# EAGLE design CAN ESC Adapter v0.1A (EAGLE 9.3.1)
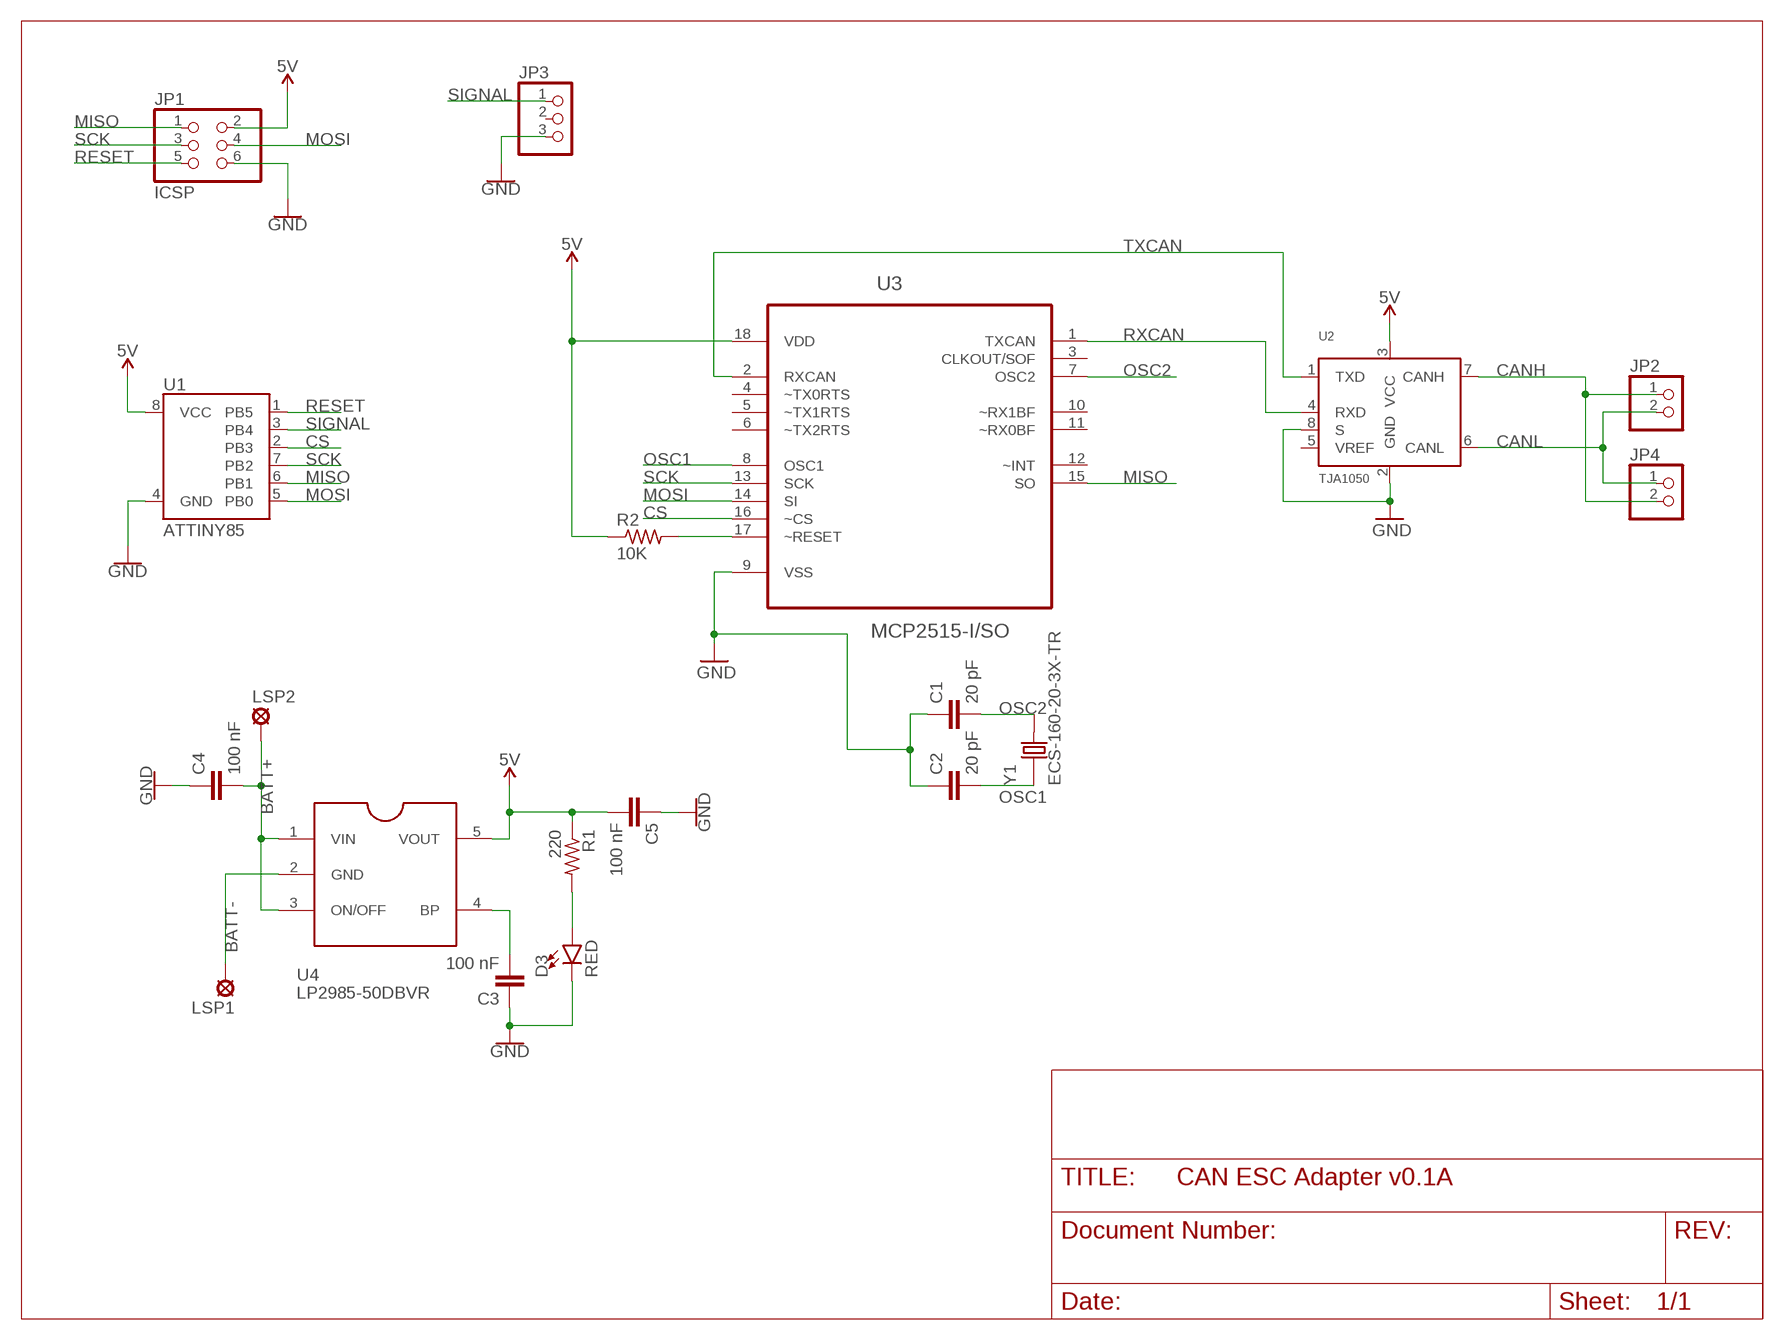
[diagram p0: schematic, sheet 1]

## Parts
C1  20 pF  C-EUC0603  [C0603]
C2  20 pF  C-EUC0603  [C0603]
C3  100 nF  C-EUC0603  [C0603]
C4  100 nF  C-EUC0603  [C0603]
C5  100 nF  C-EUC0603  [C0603]
D3  RED  LED0603  [LED-0603]
JP1  ICSP  PINHD-2X3  [2X03]
JP2  PINHD-1X2/90  [1X02/90]
JP3  PINHD-1X3/90  [1X03/90]
JP4  PINHD-1X2/90  [1X02/90]
LSP1  SE14  [SE14]
LSP2  SE14  [SE14]
R1  220  R-US_R0603  [R0603]
R2  10K  R-US_R0603  [R0603]
U1  ATTINY85  [ATTINY85]
U2  TJA1050  [SOT96-1]
U3  MCP2515-I/SO  [SOIC127P1034X264-18N]
U4  LP2985-50DBVR  [SOT23-5]
Y1  ECS-160-20-3X-TR  [XTAL_ECS-160-20-3X-TR]

## Nets
5V: C5.2 JP1.2 R1.1 R2.1 U1.8(VCC) U2.3(VCC) U3.18(VDD) U4.5(VOUT)
BATT+: C4.2 LSP2.MP U4.1(VIN) U4.3(ON/OFF)
BATT-: LSP1.MP U4.2(GND)
CANH: JP2.1 JP4.2 U2.7(CANH)
CANL: JP2.2 JP4.1 U2.6(CANL)
CS: U1.2(PB3) U3.16(~CS)
GND: C1.1 C2.1 C3.1 C4.1 C5.1 D3.C JP1.6 JP3.3 U1.4(GND) U2.2(GND) U2.8(S) U3.9(VSS)
MISO: JP1.1 U1.6(PB1) U3.15(SO)
MOSI: JP1.4 U1.5(PB0) U3.14(SI)
N$1: D3.A R1.2
N$2: R2.2 U3.17(~RESET)
N$10: C3.2 U4.4(BP)
OSC1: C2.2 U3.8(OSC1) Y1.1
OSC2: C1.2 U3.7(OSC2) Y1.2
RESET: JP1.5 U1.1(PB5)
RXCAN: U2.4(RXD) U3.1(TXCAN)
SCK: JP1.3 U1.7(PB2) U3.13(SCK)
SIGNAL: JP3.1 U1.3(PB4)
TXCAN: U2.1(TXD) U3.2(RXCAN)
Unconnected: JP3.2 U2.5(VREF) U3.3(CLKOUT/SOF) U3.4(~TX0RTS) U3.5(~TX1RTS) U3.6(~TX2RTS) U3.10(~RX1BF) U3.11(~RX0BF) U3.12(~INT)

## Library data of the parts
C1-C5 = rcl:C-EU: CAPACITOR, European symbol; SPICEPREFIX: C
D3 = SparkFun-LED:LED: LED (Generic) Standard schematic elements and footprints for 5mm, 3mm, 1206, and 0603 sized LEDs. Generic LEDs with no color specified.
JP1 = pinhead:PINHD-2X3: PIN HEADER
JP2 JP4 = pinhead:PINHD-1X2: PIN HEADER
JP3 = pinhead:PINHD-1X3: PIN HEADER
LSP1 LSP2 = solpad:SE14: SOLDER PAD E1553, drill 1,4mm, distributor Buerklin, 07F820
R1 R2 = rcl:R-US_: RESISTOR, American symbol; SPICEPREFIX: R
U1 = SparkFun-IC-Microcontroller:ATTINY85; PROD_ID: IC-09092
U2 = TJA1050:TJA1050: High speed CAN transceiver The TJA1050 is the interface between the Controller Area Network (CAN) protocol controller and the physical bus. The device provides differential transmit capability to the bus and differential receive capability to the CAN controller. The TJA1050 is the third Philips high-speed CAN transceiver after the PCA82C250 and the PCA82C251. The most important differences are: Much lower electromagnetic emission due to optimal matching of the output signals CANH and CANL Improved behaviour in case of an unpowered node No standby mode. This makes the TJA1050 eminently suitable for use in nodes that are in a power-down situation in partially powered networks. AAL Eindhoven MK; DIGI-KEY_PART_NUMBER: 568-10292-1-ND; DIGI-KEY_PURCHASE_URL: https://www.digikey.com/product-detail/en/nxp-usa-inc/TJA1050T-CM,118/568-10292-1-ND/4162437?utm_source=snapeda&utm_medium=aggregator&utm_campaign=symbol; MF: NXP USA; MP: TJA1050; PACKAGE: SOIC-8 NXP USA
U3 = MCP2515-I_SO:MCP2515-I/SO: CAN Controller; DESCRIPTION: MCP2515 Series 5.5 V 1 Mb/s Stand Alone SPI Interface CAN Controller- SOIC-18; DIGI-KEY_PART_NUMBER: MCP2515-I/SO-ND; DIGI-KEY_PURCHASE_URL: https://www.digikey.com/product-detail/en/microchip-technology/MCP2515-I-SO/MCP2515-I-SO-ND/593001?utm_source=snapeda&utm_medium=aggregator&utm_campaign=symbol; MF: Microchip; MP: MCP2515-I/SO; PACKAGE: SOIC-18 Microchip
U4 = LP2985-50DBVR:LP2985-50DBVR: http://octopart.com/lp2985-50dbvr-texas+instruments-525993; AVAILABILITY: Unavailable; DESCRIPTION: Single Output LDO, 150mA, Fixed_5.0V_, 1.5% Tolerance, Low Quiescent Current, Low Noise 5-SOT-23 -40 to 125; MF: Texas Instruments; MP: LP2985-50DBVR; PACKAGE: SOT-23 Texas Instruments; PRICE: None
Y1 = ECS-160-20-3X-TR:ECS-160-20-3X-TR: SMD QUARTZ CRYSTAL; AVAILABILITY: Unavailable; DESCRIPTION: CSM-3X Series 16 MHz ±30 ppm 20 pF -10 to +70 °C Surface Mount Quartz Crystal; MF: ECS Inc.; MP: ECS-160-20-3X-TR; PACKAGE: HC49/US ECS International; PRICE: None

## Board
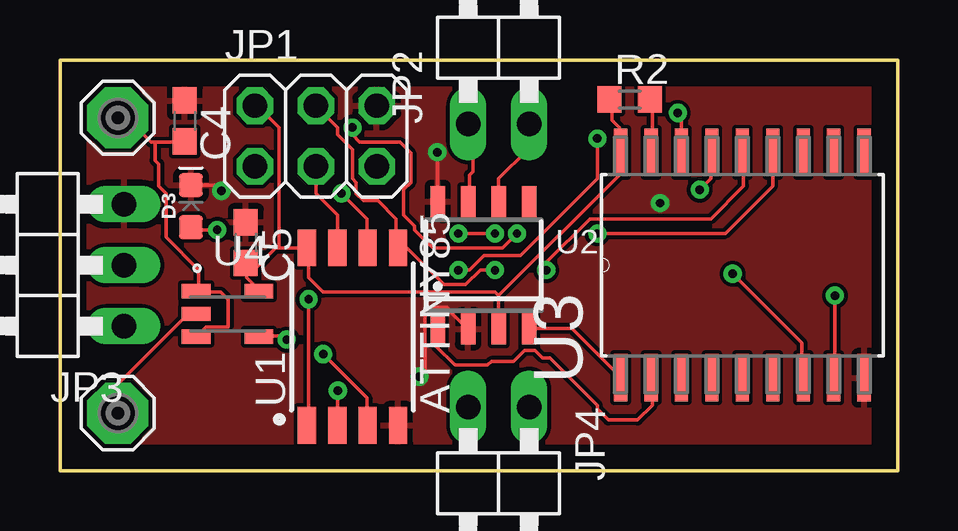
[diagram p1: board, top side]
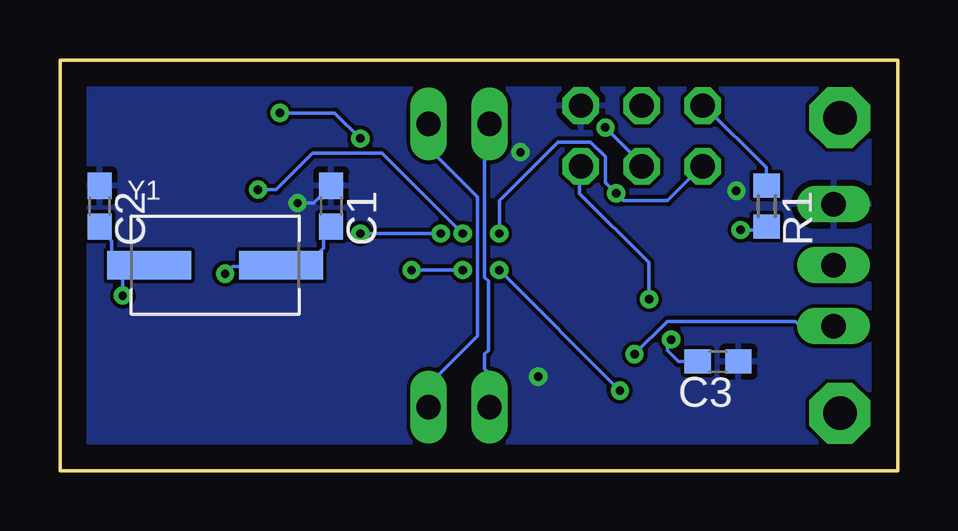
[diagram p2: board, bottom side, seen from below]

Size 34.92 x 17.14 mm. Coordinates in mm from the lower left corner, seen from the top.
Outline: 0,0 34.92,0 34.92,17.14 0,17.14 0,0
Copper layers (1*16): Top 0.035mm / dielectric 1.5mm / Bottom 0.035mm
Design rules "default": minimum track width 6mil, minimum drill 0.35mm, track to track 6mil, track to pad 6mil, pad to pad 6mil, via to via 6mil, smd to smd 6mil, copper to edge 40mil, drill to drill 6mil, minimum pad ring 10mil, minimum via ring 8mil, stop-mask expansion 4mil, vias tented up to drill 0mil, thermal gap 10mil

### Footprints (pad centres in the part's own frame; a part is rotated, then mirrored left to right if it is on the bottom)
C0603 = smd 1.1 x 1: 1 -0.85,0; 2 0.85,0
LED-0603 = smd 1 x 1: A -0.877,0; C 0.877,0
2X03 = drill 1.016 octagon: 1 -2.54,-1.27; 2 -2.54,1.27; 3 0,-1.27; 4 0,1.27; 5 2.54,-1.27; 6 2.54,1.27
1X02/90 = drill 1.016 long: 1 -1.27,-3.81; 2 1.27,-3.81
1X03/90 = drill 1.016 long: 1 -2.54,-3.81; 2 0,-3.81; 3 2.54,-3.81
SE14 = drill 1.397 pad 2.54 octagon: MP 0,0
R0603 = smd 1 x 1.1: 1 -0.85,0; 2 0.85,0
ATTINY85 = smd 1.524 x 0.762: 1 -3.683,1.905; 2 -3.683,0.635; 3 -3.683,-0.635; 4 -3.683,-1.905; 5 3.727,-1.905; 6 3.727,-0.635; 7 3.727,0.635; 8 3.727,1.905
SOT96-1 = smd 0.6 x 1.3: 1 -1.905,-2.65; 2 -0.635,-2.65; 3 0.635,-2.65; 4 1.905,-2.65; 5 1.905,2.65; 6 0.635,2.65; 7 -0.635,2.65; 8 -1.905,2.65
SOIC127P1034X264-18N = smd 1.981 x 0.559: 1 -4.699,5.08; 2 -4.699,3.81; 3 -4.699,2.54; 4 -4.699,1.27; 5 -4.699,0; 6 -4.699,-1.27; 7 -4.699,-2.54; 8 -4.699,-3.81; 9 -4.699,-5.08; 10 4.699,-5.08; 11 4.699,-3.81; 12 4.699,-2.54; 13 4.699,-1.27; 14 4.699,0; 15 4.699,1.27; 16 4.699,2.54; 17 4.699,3.81; 18 4.699,5.08
SOT23-5 = smd 1.2 x 0.6: 1 -1.306,0.95; 2 -1.306,0; 3 -1.306,-0.95; 4 1.306,-0.95; 5 1.306,0.95
XTAL_ECS-160-20-3X-TR = smd 3.5 x 1.2: 1 -2.75,0; 2 2.75,0

### Placement (x,y rotation side)
C1  23.62,11.05 270 bottom
C2  33.27,11.05 270 bottom
C3  7.49,4.57 180 bottom
C4  5.21,14.61 270 top
C5  7.75,9.53 270 top
D3  5.46,11.05 90 top
JP1  10.67,13.97 0 top
JP2  18.29,18.29 0 top
JP3  -1.14,8.59 90 top
JP4  18.29,-1.14 180 top
LSP1  2.41,2.41 0 top
LSP2  2.41,14.73 0 top
R1  5.46,11.05 270 bottom
R2  23.75,15.49 0 top
U1  12.19,5.59 90 top
U2  17.65,8.59 0 top
U3  28.45,8.59 90 top
U4  6.99,6.55 0 top
Y1  28.45,8.59 0 bottom

### Tracks (layer width: path | path; a pad name or v marks a point on that pad's centre or on a via)
5V
  Top 0.152: 7.77,8.53 7.77,8.08 8.23,7.62 U4.5 | 9.14,9.3 8.99,9.3 8.23,8.53 7.77,8.53 | 9.14,9.3 10.21,9.3 U1.8 10.36,9.3 10.36,8.08 10.97,7.47 18.14,7.47 18.29,7.32 | 7.77,8.53 C5.2 | 9.14,9.3 9.14,14.33 8.23,15.24 JP1.2 | R2.1 23.01,15.39 23.01,14.63 23.32,14.33 23.32,13.41 U3.18 23.32,13.26 23.32,12.34 18.29,7.32 | 18.29,7.32 U2.3
  Bottom 0.152: R1.1 5.49,12.04 5.49,12.65 8.08,15.24 JP1.2
BATT+
  Top 0.152: U4.3 6.09,6.02 7.01,6.02 7.01,7.16 6.71,7.47 5.79,7.47 U4.1 5.79,7.62 5.79,8.39 4.42,9.77 4.42,11.58 4.12,11.89 4.12,12.8 3.96,12.95 3.96,13.72 | 3.96,13.72 3.81,13.72 2.9,14.63 2.44,14.63 LSP2.MP | 3.96,13.72 5.18,13.72 C4.2
BATT-
  Top 0.152: U4.2 5.35,6.55 2.41,3.61 LSP1.MP
CANH
  Top 0.152: U2.7 17.07,11.28 17.07,12.34 17.22,12.5 17.22,14.33 17.07,14.48 JP2.1
  Bottom 0.152: JP4.2 17.07,2.74 17.07,4.12 17.22,4.27 17.22,4.88 17.07,5.03 17.07,7.92 17.22,8.08 17.22,14.33 17.07,14.48 JP2.1
CANL
  Top 0.152: U2.6 18.29,12.19 19.51,13.41 19.51,14.48 JP2.2
  Bottom 0.152: JP4.1 19.51,2.74 19.51,3.66 17.53,5.64 17.53,11.43 19.51,13.41 19.51,14.48 JP2.2
CS  (via drill 0.35)
  Top 0.152: v11.58,3.35 11.58,1.98 U1.2 | v16.61,8.38 17.07,8.38 17.68,8.99 19.2,8.99 22.4,12.19 v22.4,13.87 | v25.76,14.94 25.91,14.78 U3.16
  Bottom 0.152: v16.61,8.38 v11.58,3.35 | v22.4,13.87 23.47,14.94 v25.76,14.94
GND  (via drill 0.35)
  Top 0.152: U2.2 16.98,5.93 16.28,6.64 16.28,6.68 16.14,6.81 15.35,6.81 15.22,6.68 15.22,4.17 v14.99,3.94 | U2.8 15.75,13.28 v15.73,13.3 | D3.C 6.49,11.93 v6.73,11.68
  Bottom 0.152: 15.53,13.3 v15.73,13.3 15.78,13.3 | C1.1 24.34,11.18 v25.02,11.18
  pour Bottom: 0,0 34.92,0 34.92,17.14 0,17.14
  pour Top: 0.13,0 34.92,0 34.92,17.14 0,17.14 0,0
MISO  (via drill 0.35)
  Top 0.152: v11.73,11.58 12.8,10.52 12.8,9.45 U1.6 | v26.67,11.73 27.13,12.19 27.13,13.26 U3.15 | v16.61,9.91 v18.14,9.91
  Bottom 0.152: JP1.1 8.23,12.65 9.6,11.28 11.43,11.28 v11.73,11.58 12.19,12.04 12.19,13.11 12.8,13.72 14.17,13.72 16.61,11.28 v16.61,9.91 | v26.67,11.73 25.91,11.73 24.38,13.26 21.49,13.26 v18.14,9.91
MOSI  (via drill 0.35)
  Top 0.152: JP1.4 11.58,14.33 11.58,14.02 12.19,13.41 12.19,12.19 12.34,12.04 12.34,11.58 12.65,11.28 13.26,11.28 14.02,10.52 14.02,9.45 U1.5 14.17,9.3 14.48,9.3 16,7.77 16.92,7.77 17.53,8.38 v18.14,8.38 | v20.27,8.38 20.27,8.69 22.1,10.52 27.13,10.52 28.5,11.89 28.5,13.26 U3.14
  Bottom 0.152: v18.14,8.38 v20.27,8.38
N$1  (via drill 0.35)
  Top 0.152: v6.55,10.06 5.49,10.06 D3.A
  Bottom 0.152: v6.55,10.06 5.49,10.06 R1.2
N$2
  Top 0.152: R2.2 24.69,15.39 24.69,13.41 U3.17
N$10  (via drill 0.35)
  Top 0.152: v9.45,5.49 9.3,5.64 8.38,5.64 U4.4
  Bottom 0.152: C3.2 9.14,4.57 9.6,5.03 9.6,5.33 v9.45,5.49
OSC1  (via drill 0.35)
  Top 0.152: v32.31,7.32 32.31,3.96 U3.8
  Bottom 0.152: 32.31,8.69 32.77,9.14 32.77,9.6 33.22,10.06 C2.2 | 32.31,8.69 31.24,8.69 Y1.1 32.31,8.69 | 32.31,8.69 v32.31,7.32
OSC2  (via drill 0.35)
  Top 0.152: v28.04,8.23 30.94,5.33 30.94,3.96 U3.7
  Bottom 0.152: C1.2 23.62,10.06 23.93,9.75 23.93,9.3 24.54,8.69 25.6,8.69 Y1.2 25.76,8.53 27.74,8.53 v28.04,8.23
RESET  (via drill 0.35)
  Top 0.152: v10.36,7.16 10.36,1.98 U1.1
  Bottom 0.152: v10.36,7.16 10.36,8.69 13.26,11.58 13.26,12.65 JP1.5
RXCAN
  Top 0.152: U2.4 19.66,5.94 21.34,5.94 23.32,3.96 U3.1
SCK  (via drill 0.35)
  Top 0.152: JP1.3 10.67,11.58 11.58,10.67 11.58,9.45 U1.7 | U3.13 29.72,11.89 27.74,9.91 v22.4,9.91 | v19.05,9.91 18.44,9.3 15.54,9.3 14.78,10.06 14.78,10.21 14.33,10.67 14.33,11.73 14.63,12.04 14.63,13.26 14.17,13.72 12.5,13.72 12.19,14.02 v12.19,14.33
  Bottom 0.152: v19.05,9.91 v22.4,9.91 | v12.19,14.33 10.67,12.8 JP1.3
SIGNAL  (via drill 0.35)
  Top 0.152: v10.97,4.88 12.8,3.05 12.8,1.98 U1.3
  Bottom 0.152: v10.97,4.88 9.6,6.25 4.27,6.25 4.12,6.1 2.74,6.1 JP3.1
TXCAN
  Top 0.152: U2.1 15.7,5.79 15.7,5.18 16.46,4.42 17.83,4.42 17.98,4.57 18.9,4.57 19.36,5.03 19.81,5.03 20.12,4.72 20.42,4.72 22.4,2.74 22.4,2.59 22.86,2.13 24.08,2.13 24.69,2.74 24.69,3.81 U3.2

### Text on the board
tSilk: + | H | L | S | - | H | L
_bsilk: Designed 06/19 / Florida Tech, OEMS / Underwater Tech Lab | PWM-to-CAN / Interface Board / v0.1A